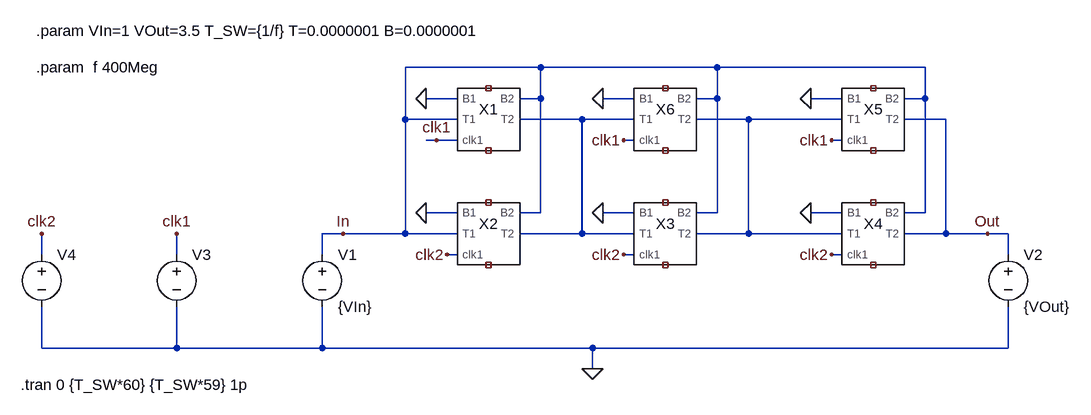
[diagram p0: schematic Dickson_Real_N=3.asc]
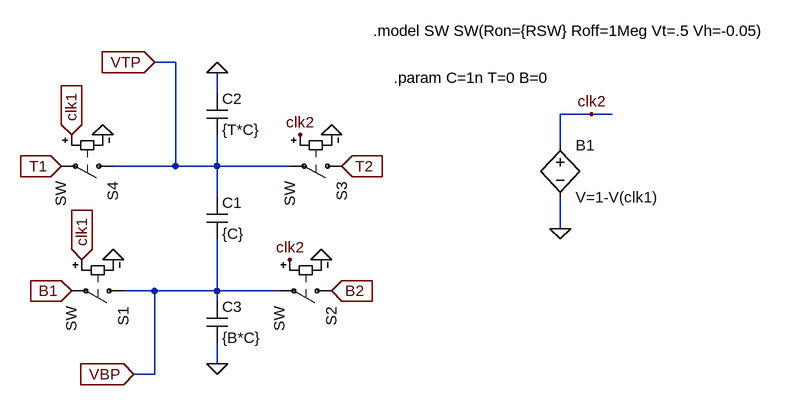
[diagram p1: sub-circuit sccore.asc]
Dickson_Real_N=3.asc, the LTspice schematic file:
Version 4
SHEET 1 1040 680
WIRE 208 96 0 96
WIRE 480 96 208 96
WIRE 800 96 480 96
WIRE 80 144 32 144
WIRE 208 144 208 96
WIRE 208 144 176 144
WIRE 352 144 304 144
WIRE 480 144 480 96
WIRE 480 144 448 144
WIRE 672 144 624 144
WIRE 800 144 800 96
WIRE 800 144 768 144
WIRE 0 176 0 96
WIRE 80 176 0 176
WIRE 272 176 176 176
WIRE 352 176 272 176
WIRE 528 176 448 176
WIRE 672 176 528 176
WIRE 832 176 768 176
WIRE 48 208 32 208
WIRE 80 208 48 208
WIRE 352 208 336 208
WIRE 672 208 656 208
WIRE 80 320 32 320
WIRE 208 320 208 144
WIRE 208 320 176 320
WIRE 352 320 304 320
WIRE 480 320 480 144
WIRE 480 320 448 320
WIRE 672 320 624 320
WIRE 800 320 800 144
WIRE 800 320 768 320
WIRE -96 352 -128 352
WIRE 0 352 0 176
WIRE 0 352 -96 352
WIRE 80 352 0 352
WIRE 272 352 272 176
WIRE 272 352 176 352
WIRE 352 352 272 352
WIRE 528 352 528 176
WIRE 528 352 448 352
WIRE 672 352 528 352
WIRE 832 352 832 176
WIRE 832 352 768 352
WIRE 896 352 832 352
WIRE 928 352 896 352
WIRE -560 384 -560 352
WIRE -352 384 -352 352
WIRE -128 384 -128 352
WIRE 80 384 64 384
WIRE 352 384 336 384
WIRE 672 384 656 384
WIRE 928 384 928 352
WIRE -560 528 -560 464
WIRE -352 528 -352 464
WIRE -352 528 -560 528
WIRE -128 528 -128 464
WIRE -128 528 -352 528
WIRE 288 528 -128 528
WIRE 928 528 928 464
WIRE 928 528 288 528
WIRE 288 560 288 528
FLAG 32 144 0
FLAG 32 320 0
FLAG 304 320 0
FLAG 304 144 0
FLAG 896 352 Out
FLAG 288 560 0
FLAG -96 352 In
FLAG 48 208 clk1
FLAG 336 208 clk1
FLAG 336 384 clk2
FLAG 64 384 clk2
FLAG 624 320 0
FLAG 624 144 0
FLAG 656 208 clk1
FLAG 656 384 clk2
FLAG -560 352 clk2
FLAG -352 352 clk1
SYMBOL voltage -128 368 R0
SYMATTR InstName V1
SYMATTR Value {VIn}
SYMBOL voltage 928 368 R0
SYMATTR InstName V2
SYMATTR Value {VOut}
SYMBOL voltage -352 368 R0
WINDOW 3 24 96 Invisible 2
WINDOW 123 0 0 Left 0
WINDOW 39 0 0 Left 0
SYMATTR Value PULSE(0 1 {0.5*T_SW} 0.001p 0.001p {0.5*T_SW} {T_SW})
SYMATTR InstName V3
SYMBOL voltage -560 368 R0
WINDOW 3 24 96 Invisible 2
WINDOW 123 0 0 Left 0
WINDOW 39 0 0 Left 0
SYMATTR Value PULSE(0 1 0 0.001p 0.001p {0.5*T_SW} {T_SW})
SYMATTR InstName V4
SYMBOL SCcore 128 176 R0
SYMATTR InstName X1
SYMATTR SpiceLine RSW=1, T = {T}, B={B}
SYMBOL SCcore 128 352 R0
SYMATTR InstName X2
SYMATTR SpiceLine RSW=1, T = {T}, B={B}
SYMBOL SCcore 400 352 R0
SYMATTR InstName X3
SYMATTR SpiceLine RSW=1, T = {T}, B={B}
SYMBOL SCcore 720 352 R0
SYMATTR InstName X4
SYMATTR SpiceLine RSW=1, T = {T}, B={B}
SYMBOL SCcore 720 176 R0
SYMATTR InstName X5
SYMATTR SpiceLine RSW=1, T = {T}, B={B}
SYMBOL SCcore 400 176 R0
SYMATTR InstName X6
SYMATTR SpiceLine RSW=1, T = {T}, B={B}
TEXT -568 40 Left 2 !.param VIn=1 VOut=3.5 T_SW={1/f} T=0.0000001 B=0.0000001
TEXT -568 96 Left 2 !.param  f 400Meg
TEXT -592 584 Left 2 !.tran 0 {T_SW*60} {T_SW*59} 1p

sccore.asc, the sub-circuit schematic file:
Version 4
SHEET 1 1152 680
WIRE 160 -128 128 -128
WIRE 224 -80 224 -112
WIRE 800 -48 752 -48
WIRE 832 -48 800 -48
WIRE 752 0 752 -48
WIRE 160 32 160 -128
WIRE 160 32 64 32
WIRE 224 32 224 -16
WIRE 224 32 160 32
WIRE 336 32 224 32
WIRE 224 80 224 32
WIRE 752 128 752 80
WIRE 128 224 80 224
WIRE 224 224 224 144
WIRE 224 224 128 224
WIRE 320 224 224 224
WIRE 224 240 224 224
WIRE 224 336 224 304
WIRE 128 352 128 224
WIRE 128 352 96 352
FLAG 224 336 0
FLAG 224 -112 0
FLAG 416 32 T2
IOPIN 416 32 In
FLAG -16 32 T1
IOPIN -16 32 In
FLAG 400 224 B2
IOPIN 400 224 In
FLAG 0 224 B1
IOPIN 0 224 In
FLAG 0 -16 clk1
IOPIN 0 -16 In
FLAG 16 176 clk1
IOPIN 16 176 In
FLAG 352 -16 clk2
FLAG 48 -16 0
FLAG 400 -16 0
FLAG 384 176 0
FLAG 64 176 0
FLAG 752 128 0
FLAG 800 -48 clk2
FLAG 336 176 clk2
FLAG 128 -128 VTP
IOPIN 128 -128 In
FLAG 96 352 VBP
IOPIN 96 352 In
SYMBOL cap 208 80 R0
SYMATTR InstName C1
SYMATTR Value {C}
SYMBOL cap 208 -80 R0
SYMATTR InstName C2
SYMATTR Value {T*C}
SYMBOL cap 208 240 R0
SYMATTR InstName C3
SYMATTR Value {B*C}
SYMBOL sw 96 224 R90
SYMATTR InstName S1
SYMBOL sw 416 224 R90
SYMATTR InstName S2
SYMBOL sw 432 32 R90
SYMATTR InstName S3
SYMBOL sw 80 32 R90
SYMATTR InstName S4
SYMBOL bv 752 -16 R0
SYMATTR InstName B1
SYMATTR Value V=1-V(clk1)
TEXT 464 -176 Left 2 !.model SW SW(Ron={RSW} Roff=1Meg Vt=.5 Vh=-0.05)
TEXT 496 -104 Left 2 !.param C=1n T=0 B=0

The netlist it stands for:
* Dickson_Real_N=3.asc
V1 In 0 {VIn}
V2 Out 0 {VOut}
V3 clk1 0 PULSE(0 1 {0.5*T_SW} 0.001p 0.001p {0.5*T_SW} {T_SW})
V4 clk2 0 PULSE(0 1 0 0.001p 0.001p {0.5*T_SW} {T_SW})
XX1 0 In clk1 In N001 NC_01 NC_02 sccore params: RSW=1, T = {T}, B={B}
XX2 0 In clk2 In N001 NC_03 NC_04 sccore params: RSW=1, T = {T}, B={B}
XX3 0 In clk2 N001 N002 NC_05 NC_06 sccore params: RSW=1, T = {T}, B={B}
XX4 0 In clk2 N002 Out NC_07 NC_08 sccore params: RSW=1, T = {T}, B={B}
XX5 0 In clk1 N002 Out NC_09 NC_10 sccore params: RSW=1, T = {T}, B={B}
XX6 0 In clk1 N001 N002 NC_11 NC_12 sccore params: RSW=1, T = {T}, B={B}

* block symbol definitions
.subckt sccore B1 B2 clk1 T1 T2 VTP VBP
C1 VTP VBP {C}
C2 0 VTP {T*C}
C3 VBP 0 {B*C}
S1 VBP B1 clk1 0 SW
S2 B2 VBP clk2 0 SW
S3 T2 VTP clk2 0 SW
S4 VTP T1 clk1 0 SW
B1 clk2 0 V=1-V(clk1)
.model SW SW(Ron={RSW} Roff=1Meg Vt=.5 Vh=-0.05)
.param C=1n T=0 B=0
.ends sccore

.param VIn=1 VOut=3.5 T_SW={1/f} T=0.0000001 B=0.0000001
.param  f 400Meg
.tran 0 {T_SW*60} {T_SW*59} 1p
.backanno
.end